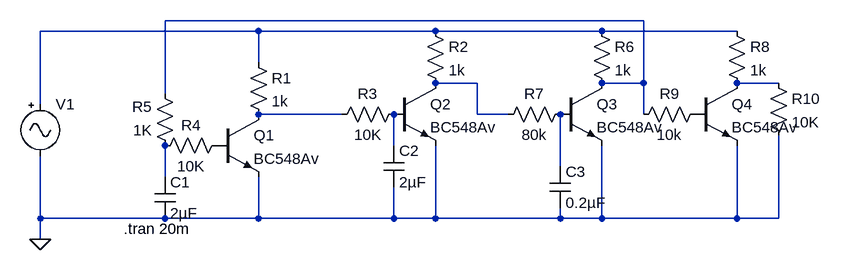
[diagram p0: schematic OsciladorNPN.asc]
OsciladorNPN.asc, the LTspice schematic file:
Version 4
SHEET 1 1072 680
WIRE 768 0 32 0
WIRE 176 16 -160 16
WIRE 448 16 176 16
WIRE 704 16 448 16
WIRE 912 16 704 16
WIRE 176 64 176 16
WIRE 512 96 448 96
WIRE 768 96 768 0
WIRE 768 96 704 96
WIRE 976 96 912 96
WIRE 32 112 32 0
WIRE -160 128 -160 16
WIRE 304 144 176 144
WIRE 512 144 512 96
WIRE 560 144 512 144
WIRE 768 144 768 96
WIRE 384 192 384 144
WIRE 640 224 640 144
WIRE 32 240 32 192
WIRE -160 304 -160 208
WIRE 32 304 -160 304
WIRE 176 304 176 240
WIRE 176 304 32 304
WIRE 384 304 384 256
WIRE 384 304 176 304
WIRE 448 304 448 192
WIRE 448 304 384 304
WIRE 640 304 640 288
WIRE 640 304 448 304
WIRE 704 304 704 192
WIRE 704 304 640 304
WIRE 912 304 912 192
WIRE 912 304 704 304
WIRE 976 304 976 176
WIRE 976 304 912 304
WIRE -160 336 -160 304
FLAG -160 336 0
SYMBOL npn 112 144 R0
SYMATTR InstName Q1
SYMATTR Value BC548Av
SYMBOL npn 384 96 R0
SYMATTR InstName Q2
SYMATTR Value BC548Av
SYMBOL res 160 48 R0
SYMATTR InstName R1
SYMATTR Value 1k
SYMBOL res 432 0 R0
SYMATTR InstName R2
SYMATTR Value 1k
SYMBOL res 288 160 R270
WINDOW 0 32 56 VTop 2
WINDOW 3 0 56 VBottom 2
SYMATTR InstName R3
SYMATTR Value 10K
SYMBOL res 16 208 R270
WINDOW 0 32 56 VTop 2
WINDOW 3 0 56 VBottom 2
SYMATTR InstName R4
SYMATTR Value 10K
SYMBOL res 48 208 R180
WINDOW 0 36 76 Left 2
WINDOW 3 36 40 Left 2
SYMATTR InstName R5
SYMATTR Value 1K
SYMBOL cap 16 240 R0
SYMATTR InstName C1
SYMATTR Value 2µF
SYMBOL Misc\\signal -160 112 R0
WINDOW 123 0 0 Left 2
WINDOW 39 0 0 Left 2
WINDOW 3 185 265 Invisible 2
SYMATTR InstName V1
SYMATTR Value 5
SYMBOL npn 640 96 R0
SYMATTR InstName Q3
SYMATTR Value BC548Av
SYMBOL res 688 0 R0
SYMATTR InstName R6
SYMATTR Value 1k
SYMBOL res 544 160 R270
WINDOW 0 32 56 VTop 2
WINDOW 3 0 56 VBottom 2
SYMATTR InstName R7
SYMATTR Value 80k
SYMBOL cap 368 192 R0
SYMATTR InstName C2
SYMATTR Value 2µF
SYMBOL cap 624 224 R0
SYMATTR InstName C3
SYMATTR Value 0.2µF
SYMBOL npn 848 96 R0
SYMATTR InstName Q4
SYMATTR Value BC548Av
SYMBOL res 896 0 R0
SYMATTR InstName R8
SYMATTR Value 1k
SYMBOL res 752 160 R270
WINDOW 0 32 56 VTop 2
WINDOW 3 0 56 VBottom 2
SYMATTR InstName R9
SYMATTR Value 10k
SYMBOL res 960 80 R0
SYMATTR InstName R10
SYMATTR Value 10K
TEXT -32 320 Left 2 !.tran 20m

The netlist it stands for:
* OsciladorNPN.asc
Q1 N005 P001 0 0 BC548Av
Q2 N003 N006 0 0 BC548Av
R1 N002 N005 1k
R2 N002 N003 1k
R3 N005 N006 10K
R4 N008 P001 10K
R5 N008 N001 1K
C1 N008 0 2µF
V1 N002 0 5
Q3 N001 N007 0 0 BC548Av
R6 N002 N001 1k
R7 N003 N007 80k
C2 N006 0 2µF
C3 N007 0 0.2µF
Q4 N004 P002 0 0 BC548Av
R8 N002 N004 1k
R9 N001 P002 10k
R10 N004 0 10K
.model NPN NPN
.model PNP PNP
.lib standard.bjt
.tran 20m
.backanno
.end